# Altium schematic sheet Main_Board_IO.SchDoc
size Letter; SheetNumber: 2; SheetTotal: 4
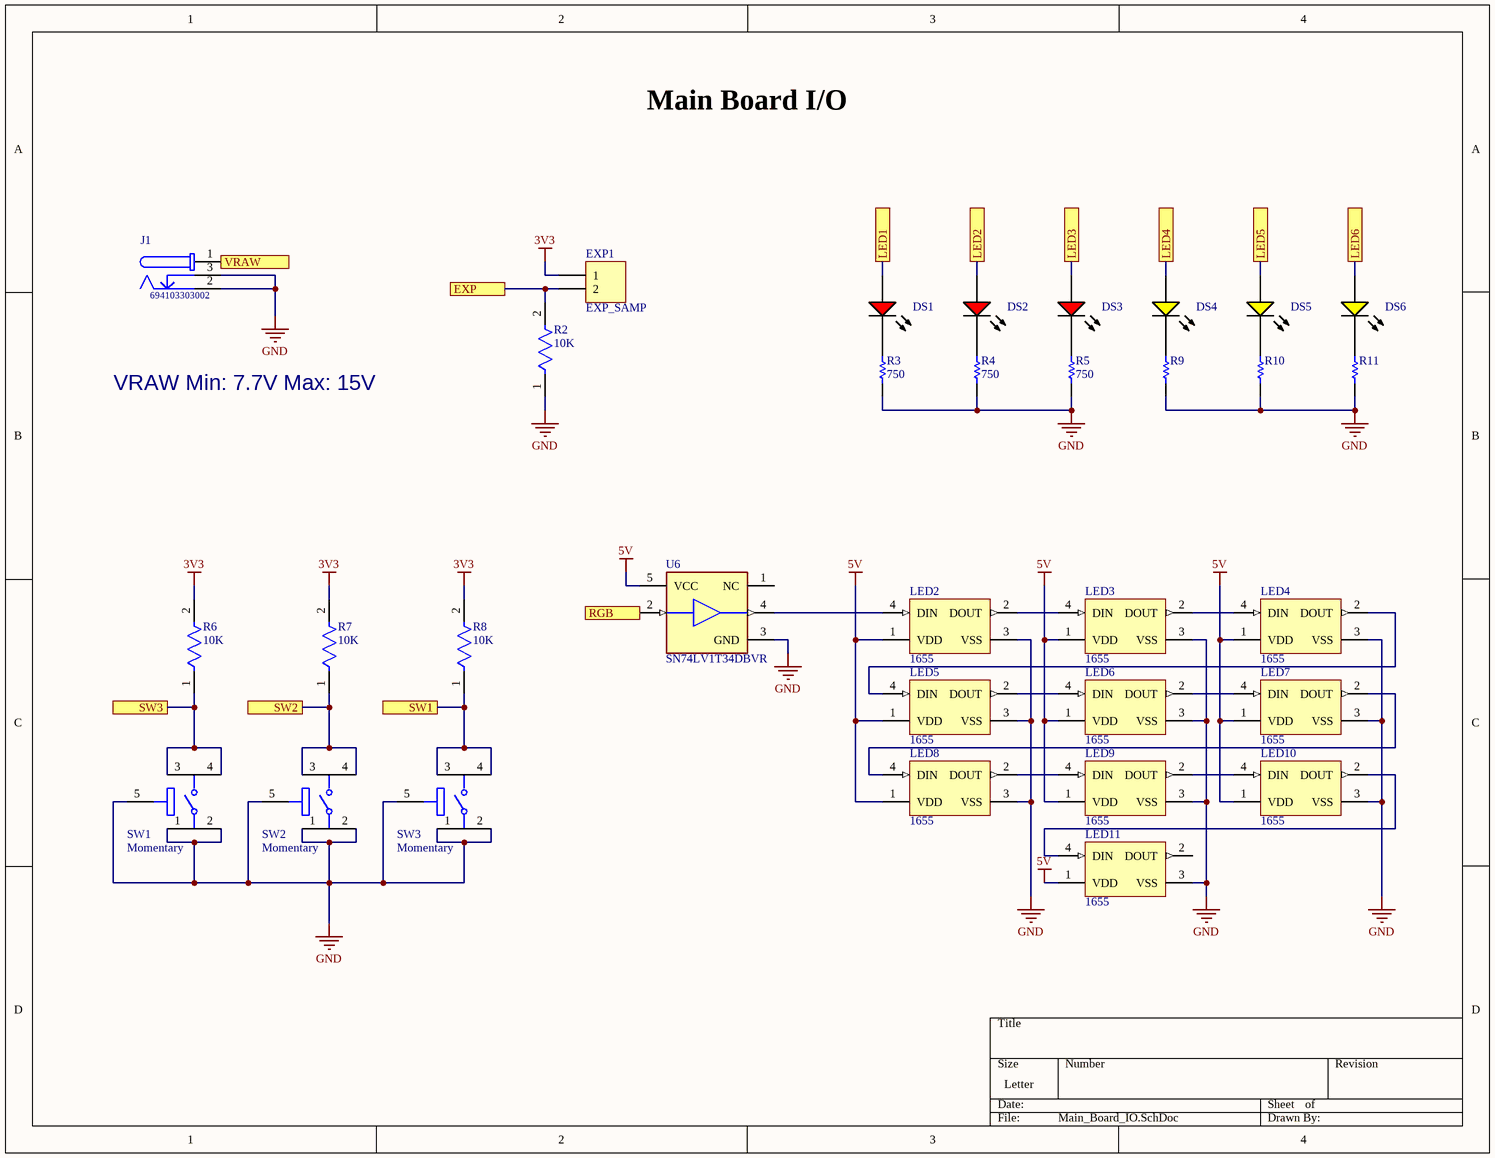
[diagram p0: Main_Board_IO.SchDoc]

## Parts
DS1  TLMS1000-GS08  [VISH-TLMS1000_V]  (value not drawn)
DS2  TLMS1000-GS08  [VISH-TLMS1000_V]  (value not drawn)
DS3  TLMS1000-GS08  [VISH-TLMS1000_V]  (value not drawn)
DS4  TLMY1000-GS08  [VISH-TLMY1000_V]  (value not drawn)
DS5  TLMY1000-GS08  [VISH-TLMY1000_V]  (value not drawn)
DS6  TLMY1000-GS08  [VISH-TLMY1000_V]  (value not drawn)
EXP1  EXP_SAMP  [HDR1X2]
J1  694103303002  [694103303002]
LED2  1655  [ADA-RGB-1655_V]
LED3  1655  [ADA-RGB-1655_V]
LED4  1655  [ADA-RGB-1655_V]
LED5  1655  [ADA-RGB-1655_V]
LED6  1655  [ADA-RGB-1655_V]
LED7  1655  [ADA-RGB-1655_V]
LED8  1655  [ADA-RGB-1655_V]
LED9  1655  [ADA-RGB-1655_V]
LED10  1655  [ADA-RGB-1655_V]
LED11  1655  [ADA-RGB-1655_V]
R2  10K  [FP-CR1206-IPC_B]
R3  750  [RESC2013X50X40LL20T20]
R4  750  [RESC2013X50X40LL20T20]
R5  750  [RESC2013X50X40LL20T20]
R6  10K  [FP-CR1206-IPC_B]
R7  10K  [FP-CR1206-IPC_B]
R8  10K  [FP-CR1206-IPC_B]
R9  RR1220P-331-D  [RESC2013X50X40LL20T20]  (value not drawn)
R10  RR1220P-331-D  [RESC2013X50X40LL20T20]  (value not drawn)
R11  RR1220P-331-D  [RESC2013X50X40LL20T20]  (value not drawn)
SW1  Momentary  [FP-B3SN-3112P-MFG]
SW2  Momentary  [FP-B3SN-3112P-MFG]
SW3  Momentary  [FP-B3SN-3112P-MFG]
U6  SN74LV1T34DBVR  [FP-DBV0005A-IPC_B]

## Ports
EXP, LED1, LED2, LED3, LED4, LED5, LED6, RGB, SW1, SW2, SW3, VRAW

## Nets
3V3: EXP1.1 R6.2 R7.2 R8.2
5V: LED2.1(VDD) LED3.1(VDD) LED4.1(VDD) LED5.1(VDD) LED6.1(VDD) LED7.1(VDD) LED8.1(VDD) LED9.1(VDD) LED10.1(VDD) LED11.1(VDD) U6.5(VCC)
GND: J1.2 J1.3 LED2.3(VSS) LED3.3(VSS) LED4.3(VSS) LED5.3(VSS) LED6.3(VSS) LED7.3(VSS) LED8.3(VSS) LED9.3(VSS) LED10.3(VSS) LED11.3(VSS) R2.1 R3.1 R4.1 R5.1 R9.1 R10.1 R11.1 SW1.1 SW1.2 SW1.5 SW2.1 SW2.2 SW2.5 SW3.1 SW3.2 SW3.5 U6.3(GND)
EXP: EXP1.2 R2.2 ; port EXP
LED1: DS1.1(A) ; port LED1
LED2: DS2.1(A) ; port LED2
LED3: DS3.1(A) ; port LED3
LED4: DS4.1(A) ; port LED4
LED5: DS5.1(A) ; port LED5
LED6: DS6.1(A) ; port LED6
RGB: U6.2(A) ; port RGB
SW1: R8.1 SW3.3 SW3.4 ; port SW1
SW2: R7.1 SW2.3 SW2.4 ; port SW2
SW3: R6.1 SW1.3 SW1.4 ; port SW3
VRAW: J1.1 ; port VRAW
NetDS1_2: DS1.2(K) R3.2
NetDS2_2: DS2.2(K) R4.2
NetDS3_2: DS3.2(K) R5.2
NetDS4_2: DS4.2(K) R9.2
NetDS5_2: DS5.2(K) R10.2
NetDS6_2: DS6.2(K) R11.2
NetLED2_2: LED2.2(DOUT) LED3.4(DIN)
NetLED2_4: LED2.4(DIN) U6.4(Y)
NetLED3_2: LED3.2(DOUT) LED4.4(DIN)
NetLED4_2: LED4.2(DOUT) LED5.4(DIN)
NetLED5_2: LED5.2(DOUT) LED6.4(DIN)
NetLED6_2: LED6.2(DOUT) LED7.4(DIN)
NetLED7_2: LED7.2(DOUT) LED8.4(DIN)
NetLED8_2: LED8.2(DOUT) LED9.4(DIN)
NetLED9_2: LED9.2(DOUT) LED10.4(DIN)
NetLED10_2: LED10.2(DOUT) LED11.4(DIN)

Not connected (* = marked no-connect by the designer): LED11 2(DOUT); U6 1(NC)

## Notes on the sheet
- Main Board I/O
- VRAW Min: 7.7V Max: 15V

## Library data of the parts
DS1-DS3 = CMP-2000-07254-1: Low Current LED, 40 mW, 1.8 V, -40 to 100 degC, 2-Pin SMD (0603), RoHS, Tape and Reel; Manufacturer: Vishay; Lens Shape: Rectangular; Automotive Qualification Standard: AEC-Q100; Wavelength Typ: 636nm; SVHC: ToBeAdvised; LED Colour: Red; Bulb Size: 1.6mmx0.8mm; Forward Voltage: 1.8V; Luminous Intensity: 4mcd; Forward Current If: 2mA; Viewing Angle: 80°; Datasheet Version: Rev. 1.7, 02/2011; Datasheet URL: https://datasheet.ciiva.com/5798/1698881-5798337.pdf; LED Mounting: SMD; Packaging: CutTape; Package Reference: TLMS1000; Manufacturer URL: http://www.vishay.com/; Mounting Technology: SurfaceMount; Product Range: -; Package Description: 2-Pin Surface Mount Device, Body 1.6 x 0.8 mm; MSL: MSL2-1year
DS4-DS6 = CMP-2000-07255-1: Low Current LED, 40 mW, -40 to 100 degC, 2-Pin SMD, RoHS, Tape and Reel; Manufacturer: Vishay; Wavelength Typ: 595nm; Forward Current If: 2mA; Viewing Angle: 80°; Bulb Size: 1.6mmx0.8mm; Forward Voltage: 1.8V; Luminous Intensity: 7.5mcd; SVHC: ToBeAdvised; Automotive Qualification Standard: AEC-Q100; LED Colour: Yellow; Lens Shape: Rectangular; LED Mounting: SMD; Mounting Technology: SurfaceMount; Packaging: CutTape; MSL: MSL2-1year; Datasheet URL: http://www.vishay.com/docs/83172/tlmo1000.pdf; Package Reference: TLMY1000; Manufacturer URL: http://www.vishay.com/; Package Description: 2-Pin Surface Mount Device, Body 1.6 x 0.8 mm; Datasheet Version: Rev. 2.0, 09/2013; Product Range: -
EXP1 = Header 2: Header, 2-Pin; LatestRevisionDate: 17-Jul-2002; LatestRevisionNote: Re-released for DXP Platform.; Publisher: Altium Limited
J1 = CMP-1502-00185-1: DC Power Jack Connector WR-DC, Male, Right Angled, THT, 2 A, 30 V; Manufacturer: Wurth Elektronik; Plug Inner Diameter: 1.35mm; Working Voltage: 30V; Plug Outer Diameter: 3.5mm; Rated Current: 2A; Opening Diameter: 4.2mm; Operating Temperature: -40to85degC; Package Reference: 694103303002; Manufacturer URL: http://www.we-online.de; Part Number: 694103303002; Datasheet URL: http://katalog.we-online.de/em/datasheet/6941xx303002.pdf; Gender: Male; Mounting Technology: THT; Packaging: Bag; Publisher: WurthElektronik; Orientation: RightAngled
LED2-LED11 = CMP-2000-05026-1: Intelligent Control LED Integrated Light Source, 3.5 to 5.3 V, -25 to 80 degC, 4-Pin SMD, RoHS, Tape and Reel; Manufacturer: Adafruit-Industries-LLC; Number of LEDs: 10; Configuration: Discrete; Utilized LED: WS2812(5050); Color: Red,Green,Blue(RGB); Datasheet URL: http://datasheet.octopart.com/ADA1655-Adafruit-Industries-datasheet-32028139.pdf; Series: Neopixel; Interface: -; Package Description: 4-Pin Surface Mount Device, Body 5 x 5 mm; Category: Optoelectronics; Controller Type: -; Package Reference: 1655; Manufacturer URL: https://www.adafruit.com/; Mounting Type: SurfaceMount; Datasheet Version: May-13; Size / Dimension: 5.00mmLx5.00mmW; Family: Addressable,Specialty
R2 R6-R8 = CMP-07231-005593-1: Thick Film Chip Resistors 1206 10kΩ 0.25W 5% 200ppm/°C; Voltage Rating: 200V; Resistance: 10kR; Max Power Dissipation: 250mW; Temperature Coefficient: 200ppm/°C; Height: 0.6mm; Case Code (Imperial): 1206; REACH SVHC: No SVHC; Depth: 1.6mm; Mount: Surface Mount; Termination: SMD/SMT; Case/Package: 1206; Min Operating Temperature: -55°C; Features: Moisture Resistant; Number of Pins: 2; Length: 3.2mm; Military Standard: Not; Radiation Hardening: No; Max Operating Temperature: 155°C; Power Rating: 250mW; Case Code (Metric): 3216; Package Quantity: 1; Composition: Thick Film; Tolerance: 5%; Voltage Rating (DC): 200V; Contact Plating: Tin; Thickness: 610um; Number of Terminations: 2; Packaging: Tape and Reel; Width: 1.6mm
R3-R5 = CMP-2001-03378-1: Manufacturer: Susumu; Part Number: RR1220P-331-D
R9-R11 = CMP-2001-03378-1: Manufacturer: Susumu; Part Number: RR1220P-331-D
SW1-SW3 = CMP-08834-000011-1: SWITCH TACTILE SPST-NO 0.05A 24V; Contact Resistance: 100mR; Switch Function: Off-Mom; Actuator Type: Standard; Mechanical Life: 50000Cycles; Illumination Type: Non-Illuminated; Contact Current Rating: 50mA; Switch Travel: 0.25mm; Ratings: IP67; Throw Configuration: SPST; Number of Poles: 1; Operating Force: 1.57N; Length: 6.5mm; Contact Plating: Silver; Weight: 0.007055oz; Mount: Surface Mount; Min Operating Temperature: -20°C; Package Quantity: 1; Depth: 7mm; Case/Package: SMD/SMT; Packaging: Tape and Reel; Electrical Life: 50000Cycles; Radiation Hardening: No; Max Current Rating: 50mA; Voltage Rating (DC): 24V; Termination: SMD/SMT; Max Operating Temperature: 70°C; Orientation: Straight; Contact Material: Gold; Current Rating: 50mA; Max Voltage Rating (DC): 24V; Lead Free: Lead Free
U6 = CMP-0859-00123-4: IC BUF NON-INVERT 5.5V SOT23-5; Low Level Output Current: 8mA; Polarity: Non-Inverting; Number of Channels: 1; Propagation Delay: 15.5ns; High Level Output Current: -8mA; Quiescent Current: 1uA; Logic Function: Buffer; Min Supply Voltage: 1.6V; Min Operating Temperature: -40°C; Package Quantity: 3000; Max Operating Temperature: 125°C; Operating Supply Current: 8mA; Radiation Hardening: No; REACH SVHC: No SVHC; Number of Bits per Element: 1; Mount: Surface Mount; Number of Outputs: 1; Lead Free: Lead Free; Number of Pins: 5; Weight: 0.000353oz; Number of Output Lines: 1; Number of Elements: 1; Number of Input Lines: 1; Number of Bits: 1; Case/Package: SOT-23-5; Packaging: Tape and Reel; Max Supply Voltage: 5.5V; Number of Inputs: 1